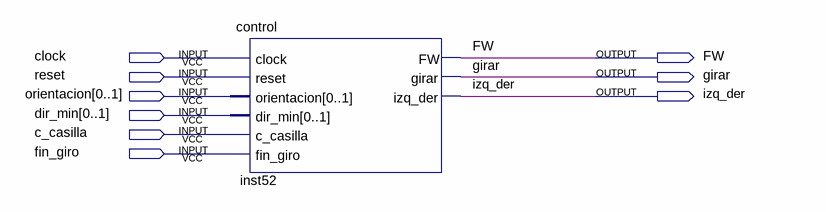
[diagram p0: schematic sheet]
// Quartus schematic prueba_control.bdf as structural Verilog: 1 symbols, 9 pins
module prueba_control (
  input  clock,
  input  reset,
  input  [0:1] orientacion,
  input  [0:1] dir_min,
  input  c_casilla,
  input  fin_giro,
  output FW,
  output girar,
  output izq_der
);

  control inst52 (
    .clock(clock), .reset(reset), .orientacion(orientacion), .dir_min(dir_min), .c_casilla(c_casilla),
    .fin_giro(fin_giro), .FW(FW), .girar(girar), .izq_der(izq_der));
endmodule
